# Altium schematic sheet MOSFETs and Driver.SchDoc
size A
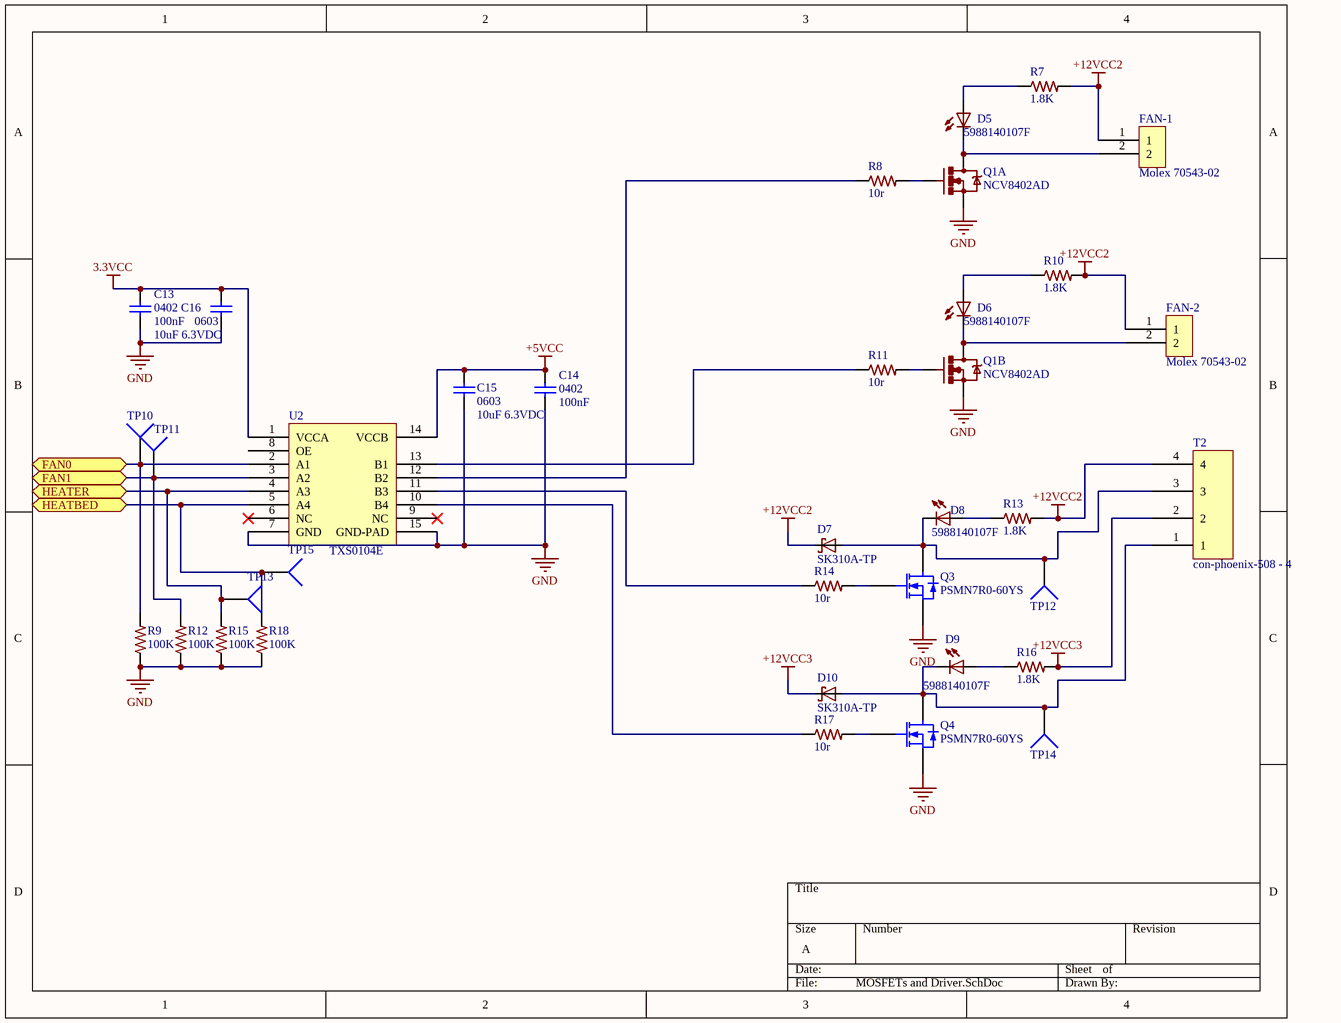
[diagram p0: MOSFETs and Driver.SchDoc]

## Parts
C13  value 100nF  [C0402]  (hidden comment: 0402)
C14  value 100nF  [C0402]  (hidden comment: 0402)
C15  0603  value 10uF 6.3VDC  [C0603]
C16  0603  value 10uF 6.3VDC  [C0603]
D5  5988140107F  [LED2012120]
D6  5988140107F  [LED2012120]
D7  SK310A-TP  [SMA-SM]
D8  5988140107F  [LED2012120]
D9  5988140107F  [LED2012120]
D10  SK310A-TP  [SMA-SM]
FAN-1  Molex 70543-02  [70543-02]
FAN-2  Molex 70543-02  [70543-02]
Q1  NCV8402AD  [NCV8402AD-SOIC8]  (parts A,B of 2)
Q3  PSMN7R0-60YS  [PSMN7R0-60YS]
Q4  PSMN7R0-60YS  [PSMN7R0-60YS]
R7  1.8K  [R0603]
R8  10r  [R0603]
R9  100K  [R0402]
R10  1.8K  [R0603]
R11  10r  [R0603]
R12  100K  [R0402]
R13  1.8K  [R0603]
R14  10r  [R0603]
R15  100K  [R0402]
R16  1.8K  [R0603]
R17  10r  [R0603]
R18  100K  [R0402]
T2  con-phoenix-508 - 4  [MSTBV4]
TP10  TP4  [TP-2]  (value not drawn)
TP11  TP4  [TP-2]  (value not drawn)
TP12  TP4  [TP-2]  (value not drawn)
TP13  TP4  [TP-2]  (value not drawn)
TP14  TP4  [TP-2]  (value not drawn)
TP15  TP4  [TP-2]  (value not drawn)
U2  TXS0104E  [RGY  (S-PVQFN-N14)]

## Ports
FAN0, FAN1, HEATBED, HEATER

## Nets
3.3VCC: C13.2 C16.2 U2.1(VCCA)
+5VCC: C14.2 C15.2 U2.14(VCCB)
+12VCC2: D7.C FAN-1.1 FAN-2.1 R7.2 R10.2 R13.2 T2.4
+12VCC3: D10.C R16.2 T2.2
GND: C13.1 C14.1 C15.1 C16.1 Q1.1(S) Q1.3(S) Q3.1(S) Q3.2(S) Q3.3(S) Q4.1(S) Q4.2(S) Q4.3(S) R9.1 R12.1 R15.1 R18.1 U2.7(GND) U2.15(GND-PAD)
FAN0: R9.2 TP10.1 U2.2(A1) ; port FAN0
FAN1: R12.2 TP11.1 U2.3(A2) ; port FAN1
HEATBED: R18.2 TP15.1 U2.5(A4) ; port HEATBED
HEATER: R15.2 TP13.1 U2.4(A3) ; port HEATER
NetD5_A: D5.A R7.1
NetD5_C: D5.C FAN-1.2 Q1.7(D)
NetD6_A: D6.A R10.1
NetD6_C: D6.C FAN-2.2 Q1.5(D)
NetD7_A: D7.A D8.C Q3.5(D) T2.3 TP12.1
NetD8_A: D8.A R13.1
NetD9_A: D9.A R16.1
NetD9_C: D9.C D10.A Q4.5(D) T2.1 TP14.1
NetQ1_2: Q1.2(G) R8.2
NetQ1_4: Q1.4(G) R11.2
NetQ3_4: Q3.4(G) R14.2
NetQ4_4: Q4.4(G) R17.2
NetR8_1: R8.1 U2.12(B2)
NetR11_1: R11.1 U2.13(B1)
NetR14_1: R14.1 U2.11(B3)
NetR17_1: R17.1 U2.10(B4)

Not connected (* = marked no-connect by the designer): U2 6(NC)* 8(OE) 9(NC)*

## Library data of the parts
C13 C14 = GRM155R71C104KA88D: CAP CER 0.1UF (100nF) 16V 10% X7R 0402; MFR: Murata; Part Description: CAP CER 0.1UF 16V 10% X7R 0402; Published: 10 - Dec - 2014; LatestRevisionDate: 10 - Dec - 2014; LatestRevisionNote: Ultimachine Footprint Added; Publisher: Ultimachine; Component Type: Chip Capacitor; MFR Part #: GRM155R71C104KA88D; Mounting Type: SMT 0402; Datasheet: http://psearch.murata.com/capacitor/product/GRM155R71C104KA88%23.pdf; Height: 0.5 ±0.05mm; Tolerance: 10%; Voltage: 16v; PackageReference: 0402
C15 C16 = C1608JB0J106K080AB: CAP CER 10UF 6.3V 10% JB 0603; MFR: TDK; Voltage: 6.3VDC; Published: 10 - Dec - 2014; LatestRevisionDate: 10 - Dec - 2014; Component Type: Chip Capacitor; MFR Part #: C1608JB0J106K080AB; Part Description: CAP CER 10UF 6.3V 10% JB 0603; Mounting Type: SMT 0603; Datasheet: http://www.tdk.com/pdf/TDKMLCCCapRange.pdf; Height: 0.9mm; Tolerance: 10%; Digikey #: 445-11185-1-ND; PackageReference: 0402
D5 D6 D8 D9 = 5988140107F: LED 0805 Yellow; LastRevisionNote: ImportComponents; Published: 23-Apr-2014; Publisher: UltiMachine; LastRevisionDate: 23-Apr-2014; VALUE: 5988140107F
D7 D10 = SK310A: DIODE Schottky 3A SMA; LastRevisionNote: ImportComponents; LastRevisionDate: 23-Apr-2014; ManufacturerPartNumber: SK310A; Published: 23-Apr-2014; Publisher: UltiMachine
Q3 Q4 = PSMN7R0-60YS: N-Channel MOSFET; Published: 8-Jun-2000; LatestRevisionDate: 17-Jul-2002; LatestRevisionNote: Re-released for DXP Platform.; PackageVersion: 1995/1996; PackageReference: E3; Publisher: Altium Limited; PackageDescription: TO, Flat Index; 3 In-Line, Axial Leads; Body Dia. 4.6mm; Lead Dia. 0.5 mm (max)
R7 R10 R13 R16 = RC0603JR-071K8L: RES 0603 1.8K 100mW 5%; LastRevisionNote: ImportComponents; Published: 23-Apr-2014; Publisher: UltiMachine; LastRevisionDate: 23-Apr-2014; ManufacturerPartNumber: RC0603JR-071K8L; VALUE: 1.8K
R8 R11 R14 R17 = CRCW060310R0FKEA: RES 0603 10r 100mW 1%; LastRevisionNote: ImportComponents; Published: 23-Apr-2014; Publisher: UltiMachine; LastRevisionDate: 23-Apr-2014; ManufacturerPartNumber: CRCW060310R0FKEA; VALUE: 10r
R9 R12 R15 R18 = RC1005F104CS: RES SMD 100K OHM 1% 1/16W 0402; Manufacturer: Samsung; LastRevisionNote: ImportComponents; Digilkey #: 1276-3432-1-ND; Published: 23-Apr-2014; Publisher: UltiMachine; LastRevisionDate: 23-Apr-2014; ManufacturerPartNumber: RC1005F104CS; VALUE: 100K
T2 = con-phoenix-508_4
TP10-TP15 = Socket: LatestRevisionDate: 17-Jul-2002; LatestRevisionNote: Re-released for DXP Platform.; Publisher: Altium Limited
U2 = TXS0104E: TXS0104E - Bidriectional Opendrain/pushpull level shift; MFR: Texas Instruments; MFR Part #: TXS0104ERGYR; Active: Yes; Digikey Part #: 296-20698-2-ND; Height: 1mm; mounting Type: SMD; Datasheet: http://www.ti.com/lit/ds/symlink/txs0104e.pdf; Lead Free ?: RhoS